# EAGLE design MCB-USI-WM-BN-BM-22-v1.0.0 (EAGLE 7.7.0)

## Sheet 1 of 2
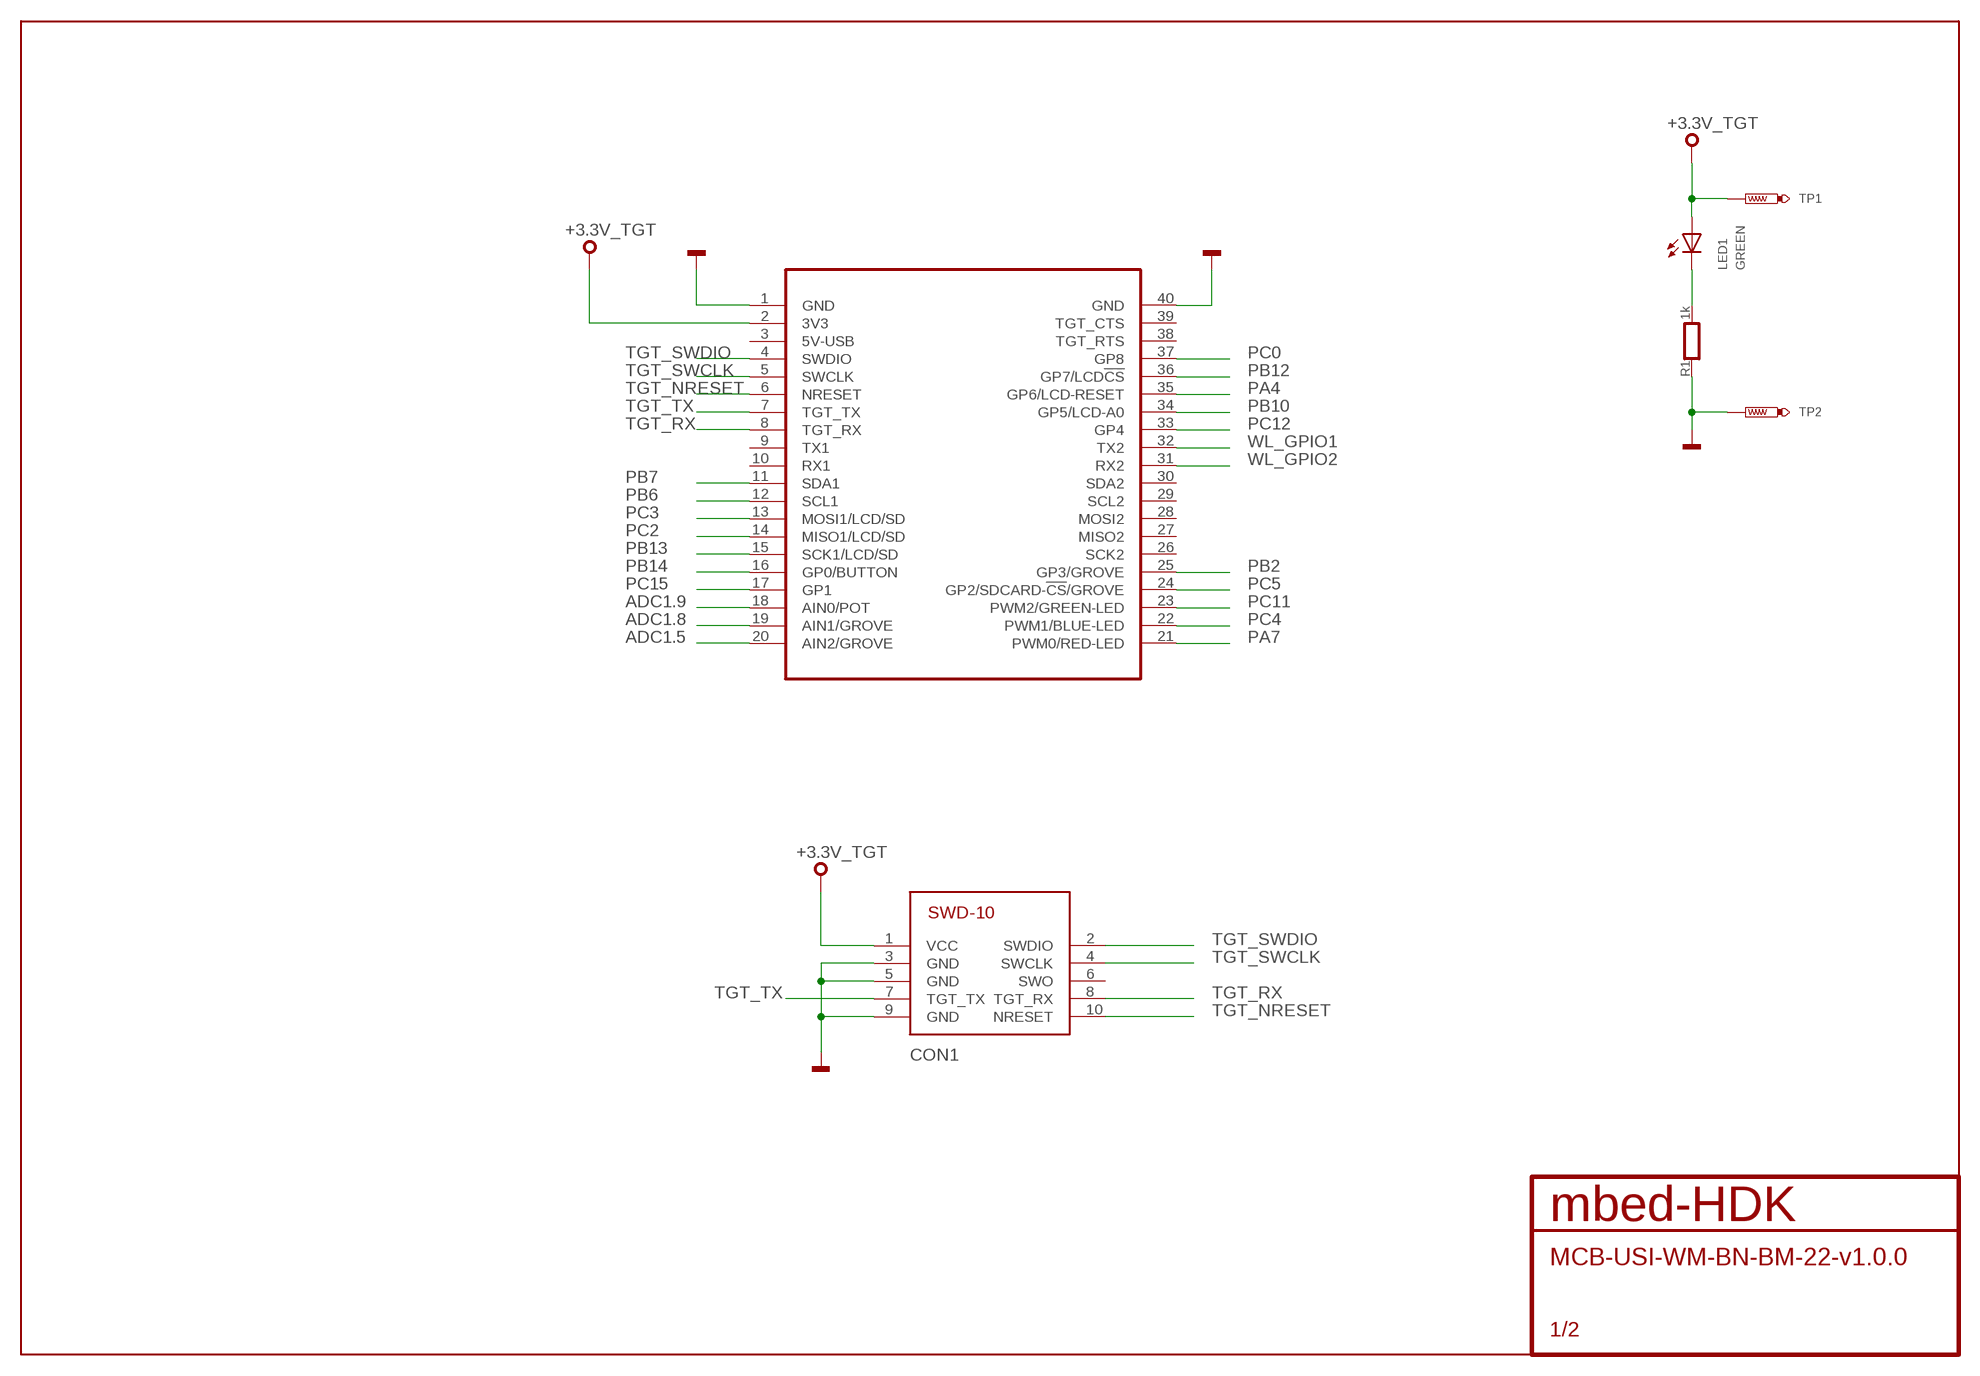
[diagram p0: schematic, sheet 1]

### Parts
CON1  SWD-10/TC2050_SMD  [FTSH-105-02]
LED1  GREEN  SMD_LED0603  [CHIPLED_0603]
MOD1  MODULE_DAUGHTER  [MODULE_DAUGHTER]
R1  1k  R0603  [0603]
TP1  TEST_POINT-50R-PTH  [TP50-PTH]
TP2  TEST_POINT-50R-PTH  [TP50-PTH]

### Nets
+3.3V_TGT: CON1.1(VCC) LED1.A MOD1.2(3V3) TP1.TP ; also sheet 2
ADC1.5: MOD1.20(AIN2/GROVE) ; also sheet 2
ADC1.8: MOD1.19(AIN1/GROVE) ; also sheet 2
ADC1.9: MOD1.18(AIN0/POT) ; also sheet 2
GND: CON1.3(GND) CON1.5(GND) CON1.9(GND) MOD1.1(GND) MOD1.40(GND) R1.1 TP2.TP ; also sheet 2
PA4: MOD1.35(GP6/LCD-RESET) ; also sheet 2
PA7: MOD1.21(PWM0/RED-LED) ; also sheet 2
PA_1: LED1.C R1.2
PB2: MOD1.25(GP3/GROVE) ; also sheet 2
PB6: MOD1.12(SCL1) ; also sheet 2
PB7: MOD1.11(SDA1) ; also sheet 2
PB10: MOD1.34(GP5/LCD-A0) ; also sheet 2
PB12: MOD1.36(GP7/LCD!CS) ; also sheet 2
PB13: MOD1.15(SCK1/LCD/SD) ; also sheet 2
PB14: MOD1.16(GP0/BUTTON) ; also sheet 2
PC0: MOD1.37(GP8) ; also sheet 2
PC2: MOD1.14(MISO1/LCD/SD) ; also sheet 2
PC3: MOD1.13(MOSI1/LCD/SD) ; also sheet 2
PC4: MOD1.22(PWM1/BLUE-LED) ; also sheet 2
PC5: MOD1.24(GP2/SDCARD-!CS!/GROVE) ; also sheet 2
PC11: MOD1.23(PWM2/GREEN-LED) ; also sheet 2
PC12: MOD1.33(GP4) ; also sheet 2
PC15: MOD1.17(GP1) ; also sheet 2
TGT_NRESET: CON1.10(NRESET) MOD1.6(NRESET) ; also sheet 2
TGT_RX: CON1.8(TGT_RX) MOD1.8(TGT_RX) ; also sheet 2
TGT_SWCLK: CON1.4(SWCLK) MOD1.5(SWCLK) ; also sheet 2
TGT_SWDIO: CON1.2(SWDIO) MOD1.4(SWDIO) ; also sheet 2
TGT_TX: CON1.7(TGT_TX) MOD1.7(TGT_TX) ; also sheet 2
WL_GPIO1: MOD1.32(TX2) ; also sheet 2
WL_GPIO2: MOD1.31(RX2) ; also sheet 2
Unconnected: CON1.6(SWO) MOD1.3(5V-USB) MOD1.9(TX1) MOD1.10(RX1) MOD1.26(SCK2) MOD1.27(MISO2) MOD1.28(MOSI2) MOD1.29(SCL2) MOD1.30(SDA2) MOD1.38(TGT_RTS) MOD1.39(TGT_CTS)

## Sheet 2 of 2
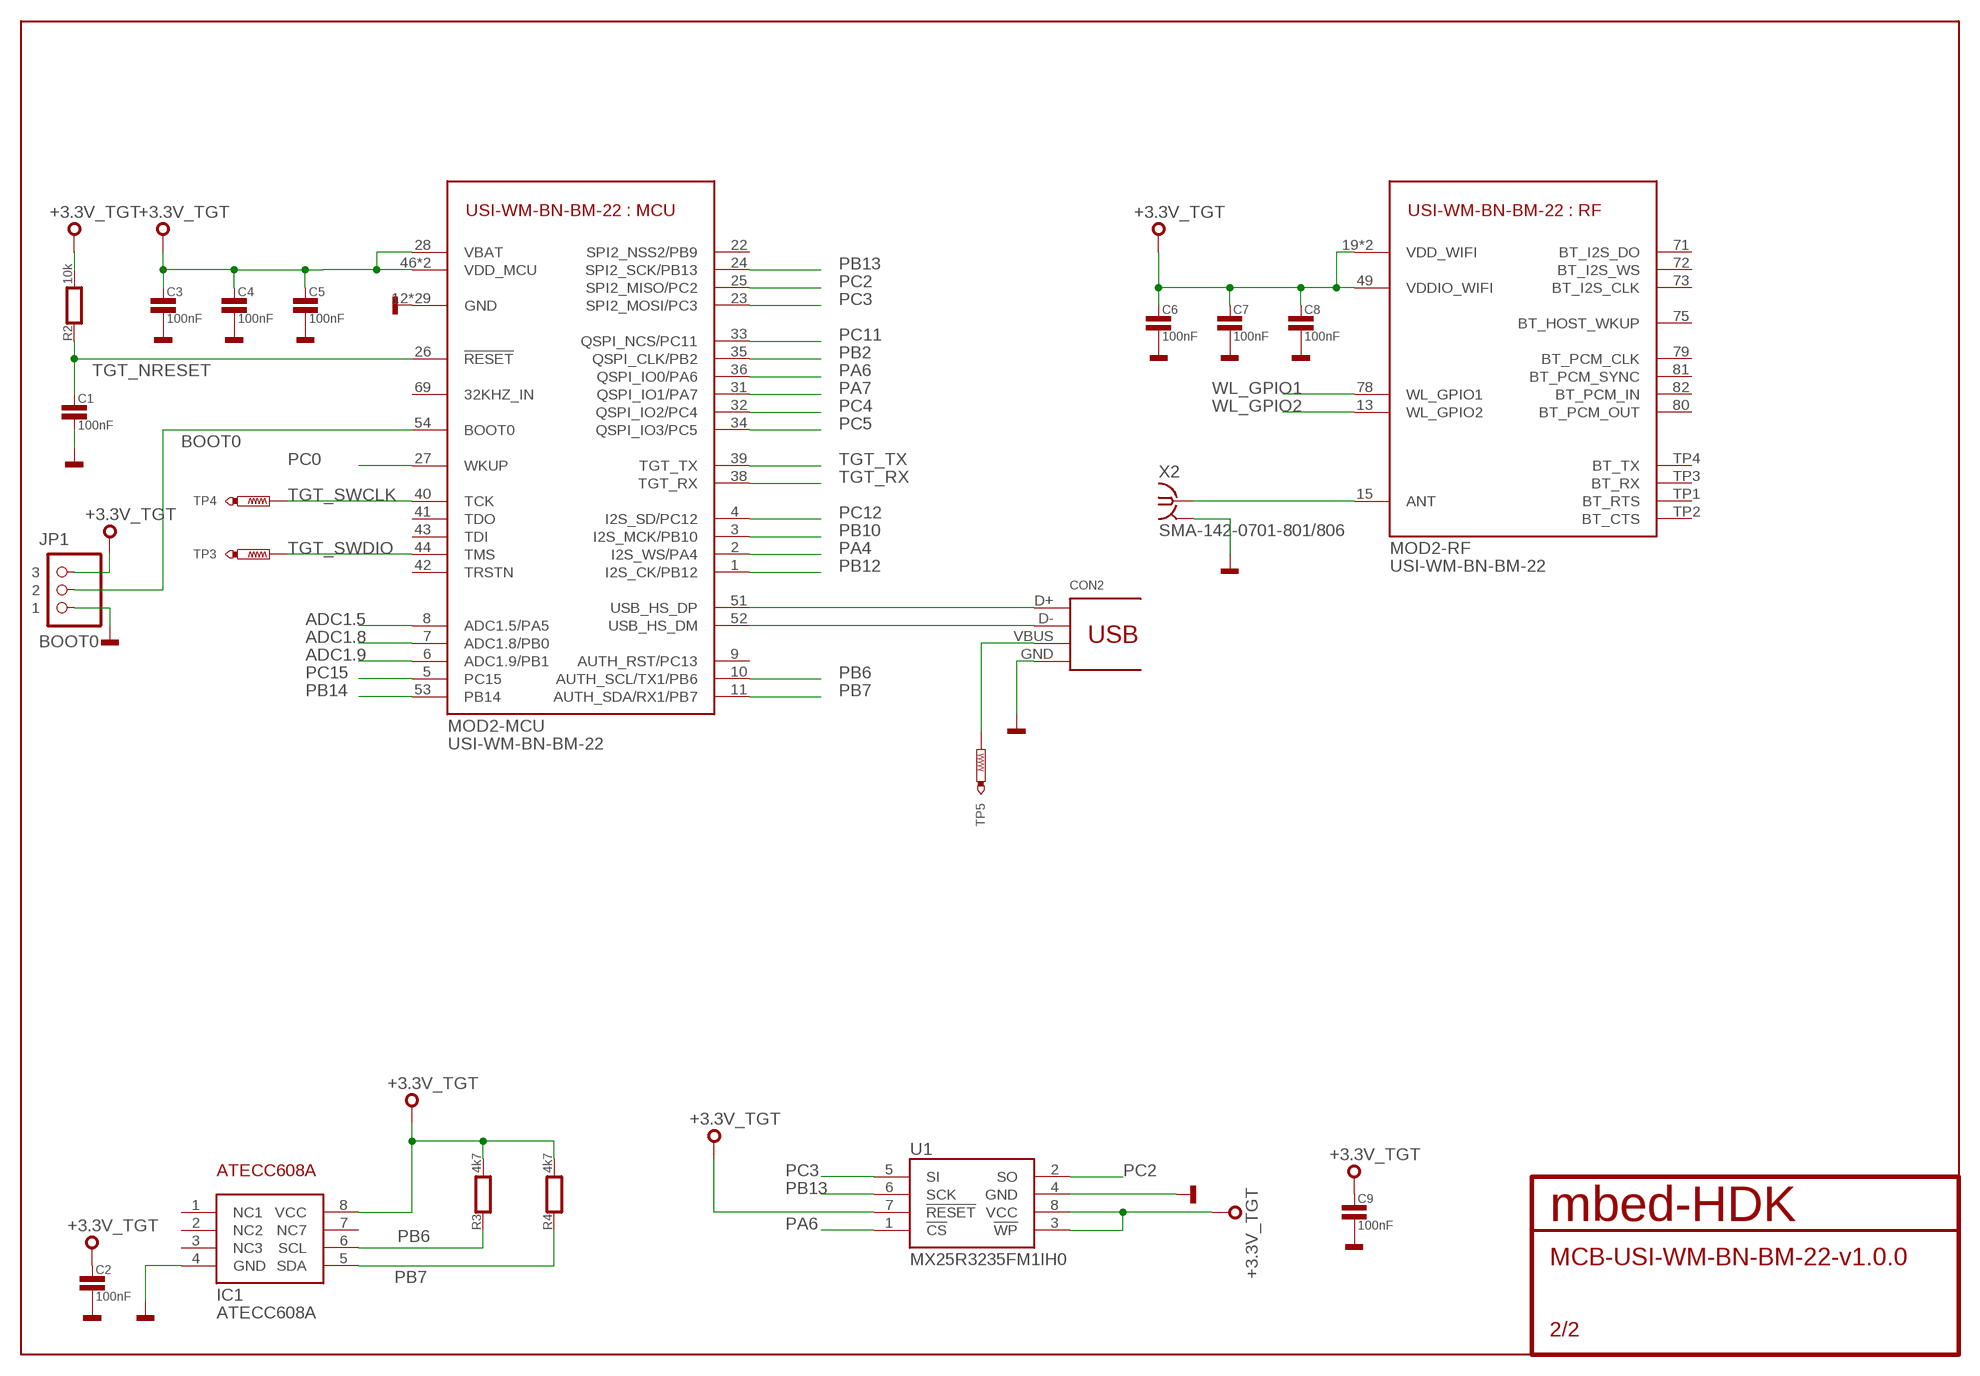
[diagram p1: schematic, sheet 2]

### Parts
C1  100nF  C0603  [0603]
C2  100nF  C0603  [0603]
C3  100nF  C0603  [0603]
C4  100nF  C0603  [0603]
C5  100nF  C0603  [0603]
C6  100nF  C0603  [0603]
C7  100nF  C0603  [0603]
C8  100nF  C0603  [0603]
C9  100nF  C0603  [0603]
CON2  47346-0001  [USB-MICRO-B-H]
IC1  ATECC608A  [SO8]
JP1  BOOT0  PINHD-1X3  [1X03]
MOD2  USI-WM-BN-BM-22  [USI-WM-BN-BM-22]
R2  10k  R0603  [0603]
R3  4k7  R0603  [0603]
R4  4k7  R0603  [0603]
TP3  TEST_POINT-50R-SMD  [TP50-SMD]
TP4  TEST_POINT-50R-SMD  [TP50-SMD]
TP5  TEST_POINT-50R-SMD  [TP50-SMD]
U1  MX25R3235FM1IH0  [SO8]
X2  SMA-142-0701-801/806  [J502-ND-142-0701-801/806]

### Nets
+3.3V_TGT: C2.1 C3.1 C4.1 C5.1 C6.1 C7.1 C8.1 C9.1 IC1.8(VCC) JP1.3 MOD2.19(-RF:VDD_WIFI) MOD2.20(-RF:VDD_WIFI) MOD2.28(-MCU:VBAT) MOD2.46(-MCU:VDD_MCU) MOD2.47(-MCU:VDD_MCU) MOD2.49(-RF:VDDIO_WIFI) R2.2 R3.2 R4.2 U1.3(!WP) U1.7(!RESET) U1.8(VCC) ; also sheet 1
ADC1.5: MOD2.8(-MCU:ADC1.5/PA5) ; also sheet 1
ADC1.8: MOD2.7(-MCU:ADC1.8/PB0) ; also sheet 1
ADC1.9: MOD2.6(-MCU:ADC1.9/PB1) ; also sheet 1
BOOT0: JP1.2 MOD2.54(-MCU:BOOT0)
GND: C1.2 C2.2 C3.2 C4.2 C5.2 C6.2 C7.2 C8.2 C9.2 CON2.GND IC1.4(GND) JP1.1 MOD2.12(-MCU:GND) MOD2.14(-MCU:GND) MOD2.16(-MCU:GND) MOD2.17(-MCU:GND) MOD2.18(-MCU:GND) MOD2.21(-MCU:GND) MOD2.29(-MCU:GND) MOD2.30(-MCU:GND) MOD2.37(-MCU:GND) MOD2.45(-MCU:GND) MOD2.48(-MCU:GND) MOD2.50(-MCU:GND) MOD2.55(-MCU:GND) MOD2.56(-MCU:GND) MOD2.57(-MCU:GND) MOD2.58(-MCU:GND) MOD2.59(-MCU:GND) MOD2.60(-MCU:GND) MOD2.61(-MCU:GND) MOD2.62(-MCU:GND) MOD2.63(-MCU:GND) MOD2.64(-MCU:GND) MOD2.65(-MCU:GND) MOD2.66(-MCU:GND) MOD2.67(-MCU:GND) MOD2.68(-MCU:GND) MOD2.70(-MCU:GND) MOD2.74(-MCU:GND) MOD2.83(-MCU:GND) U1.4(GND) X2.G@1 X2.G@2 X2.G@3 X2.G@4 ; also sheet 1
N$2: CON2.D+ MOD2.51(-MCU:USB_HS_DP)
N$3: CON2.D- MOD2.52(-MCU:USB_HS_DM)
N$5: CON2.VBUS TP5.TP
N$6: MOD2.15(-RF:ANT) X2.1
PA4: MOD2.2(-MCU:I2S_WS/PA4) ; also sheet 1
PA6: MOD2.36(-MCU:QSPI_IO0/PA6) U1.1(!CS)
PA7: MOD2.31(-MCU:QSPI_IO1/PA7) ; also sheet 1
PB2: MOD2.35(-MCU:QSPI_CLK/PB2) ; also sheet 1
PB6: IC1.6(SCL) MOD2.10(-MCU:AUTH_SCL/TX1/PB6) R3.1 ; also sheet 1
PB7: IC1.5(SDA) MOD2.11(-MCU:AUTH_SDA/RX1/PB7) R4.1 ; also sheet 1
PB10: MOD2.3(-MCU:I2S_MCK/PB10) ; also sheet 1
PB12: MOD2.1(-MCU:I2S_CK/PB12) ; also sheet 1
PB13: MOD2.24(-MCU:SPI2_SCK/PB13) U1.6(SCK) ; also sheet 1
PB14: MOD2.53(-MCU:PB14) ; also sheet 1
PC0: MOD2.27(-MCU:WKUP) ; also sheet 1
PC2: MOD2.25(-MCU:SPI2_MISO/PC2) U1.2(SO) ; also sheet 1
PC3: MOD2.23(-MCU:SPI2_MOSI/PC3) U1.5(SI) ; also sheet 1
PC4: MOD2.32(-MCU:QSPI_IO2/PC4) ; also sheet 1
PC5: MOD2.34(-MCU:QSPI_IO3/PC5) ; also sheet 1
PC11: MOD2.33(-MCU:QSPI_NCS/PC11) ; also sheet 1
PC12: MOD2.4(-MCU:I2S_SD/PC12) ; also sheet 1
PC15: MOD2.5(-MCU:PC15) ; also sheet 1
TGT_NRESET: C1.1 MOD2.26(-MCU:!RESET) R2.1 ; also sheet 1
TGT_RX: MOD2.38(-MCU:TGT_RX) ; also sheet 1
TGT_SWCLK: MOD2.40(-MCU:TCK) TP4.TP ; also sheet 1
TGT_SWDIO: MOD2.44(-MCU:TMS) TP3.TP ; also sheet 1
TGT_TX: MOD2.39(-MCU:TGT_TX) ; also sheet 1
WL_GPIO1: MOD2.78(-RF:WL_GPIO1) ; also sheet 1
WL_GPIO2: MOD2.13(-RF:WL_GPIO2) ; also sheet 1
Unconnected: IC1.1(NC1) IC1.2(NC2) IC1.3(NC3) IC1.7(NC7) MOD2.9(-MCU:AUTH_RST/PC13) MOD2.22(-MCU:SPI2_NSS2/PB9) MOD2.41(-MCU:TDO) MOD2.42(-MCU:TRSTN) MOD2.43(-MCU:TDI) MOD2.69(-MCU:32KHZ_IN) MOD2.71(-RF:BT_I2S_DO) MOD2.72(-RF:BT_I2S_WS) MOD2.73(-RF:BT_I2S_CLK) MOD2.75(-RF:BT_HOST_WKUP) MOD2.79(-RF:BT_PCM_CLK) MOD2.80(-RF:BT_PCM_OUT) MOD2.81(-RF:BT_PCM_SYNC) MOD2.82(-RF:BT_PCM_IN) MOD2.TP1(-RF:BT_RTS) MOD2.TP2(-RF:BT_CTS) MOD2.TP3(-RF:BT_RX) MOD2.TP4(-RF:BT_TX)

## Library data of the parts
C1-C9 = mbed-HDK-RLC:C: Capacitor
CON1 = mbed-HDK-Connector:SWD-10/TC2050: 1mm pitch 10-Pin Cortex Programming Header with optional TC2050 footprint solderless interchangeable
CON2 = mbed-HDK-Connector:47346-0001: USB Receptacle Horizontal Micro Type B; MF: MOLEX; MFN: 47346-0001; OC-MOUSER: 538-47346-0001; OC-NEWARK: 1568026
IC1 = mbed-HDK-MF-ATMEL:ATECC608A: I2C Secure element and crytpo accelerator; MF: Atmel; MFN: ATECC608A; OC-DIGIKEY: ATECC608A-SSHDA-TCT-ND; OC-MOUSER: 556-ATECC608ASSHDAB
JP1 = mbed-HDK-Connector:PINHD-1X3: PIN HEADER
LED1 = mbed-HDK-Optical:SMD_LED: LED SMD, Colour Red; MF: Wurth Electronics Inc; MFN: 150060RS75000; OC-DIGIKEY: 732-4978-1-ND; OC-MOUSER: 710-150060RS75000; OC-NEWARK: 2322071
MOD1 = mbed-HDK-misc-Board:MODULE_DAUGHTER
MOD2 = mbed-HDK-Modules:USI-WM-BN-BM-22
R1-R4 = mbed-HDK-RLC:R: Resistor
TP1-TP5 = mbed-HDK-Connector:TEST_POINT
U1 = mbed-HDK-IC:MX25R3235FM1IH0: Serial Flash 32 Mb 80 Mhz; MF: Macronix; MFN: MX25R3235FM1IH0; OC-DIGIKEY: 1092-1175-ND
X2 = mbed-HDK-Connector:SMA-: SMA 50 Ohm End Launch Jack Receptacle - Round Contact Johnson Components Source: www.johnsoncomponents.com .. J502-ND.pdf; MF: JOHNSON COMPONENTS; MPN: 142-0701-801; OC_FARNELL: 1608592; OC_NEWARK: 90F2624

## Board
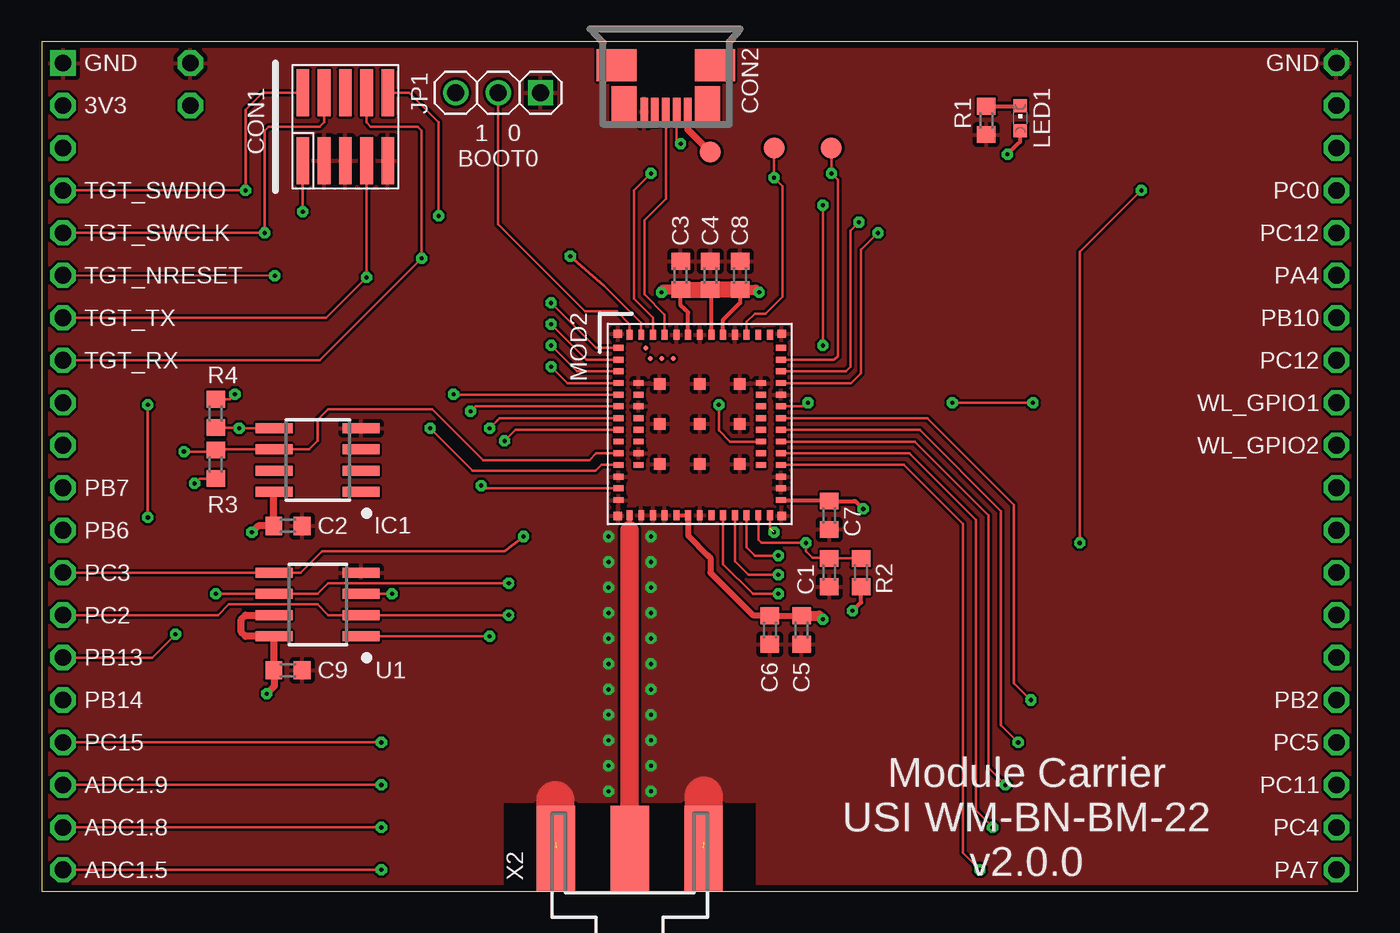
[diagram p2: board, top side]
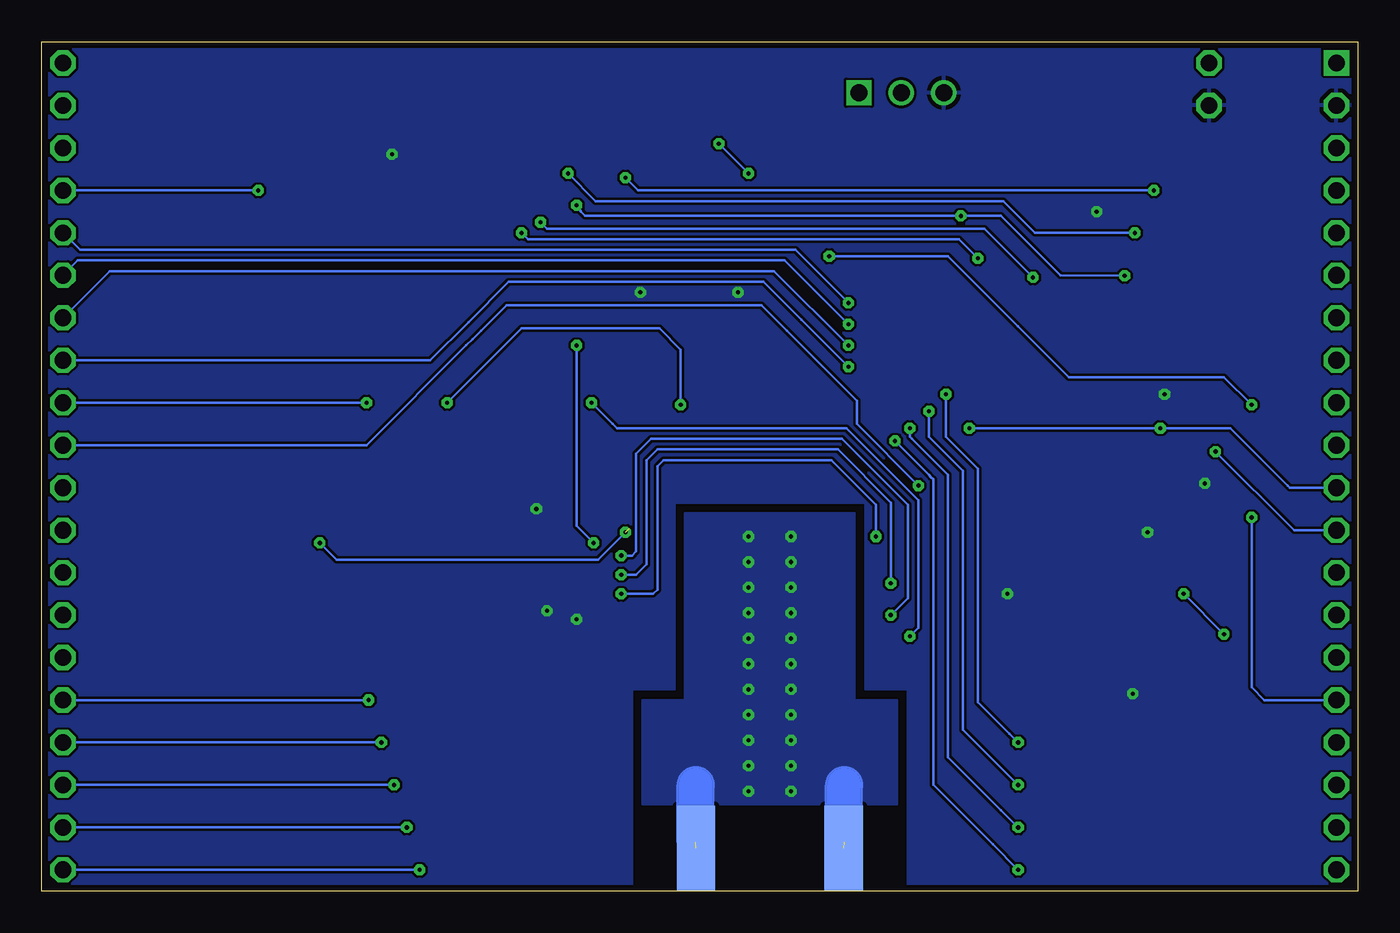
[diagram p3: board, bottom side, seen from below]

Size 78.74 x 50.8 mm. Coordinates in mm from the lower left corner, seen from the top.
Copper layers ((1*16)): Top 0.035mm / dielectric 0.8mm / Bottom 0.035mm
Design rules "mbed-HDK-6-6-2-layer": minimum track width 6mil, minimum drill 9mil, track to track 6mil, track to pad 6mil, pad to pad 6mil, via to via 6mil, smd to smd 6mil, copper to edge 15mil, drill to drill 8mil, minimum pad ring 10mil, minimum via ring 8mil, stop-mask expansion 4mil, vias tented up to drill 0mil, thermal gap 10mil

### Footprints (pad centres in the part's own frame; a part is rotated, then mirrored left to right if it is on the bottom)
0603 = smd 1 x 1.1: 1 -0.85,0; 2 0.85,0
FTSH-105-02 = smd 0.762 x 2.794: 1 0.381,-2.032; 2 0.381,2.032; 3 1.651,-2.032; 4 1.651,2.032; 5 2.921,-2.032; 6 2.921,2.032; 7 4.191,-2.032; 8 4.191,2.032; 9 5.461,-2.032; 10 5.461,2.032
USB-MICRO-B-H = smd 1.7 x 0.45: 4 2.8,-0.65; D+ 2.8,0; D- 2.8,0.65; GND 2.8,-1.3; VBUS 2.8,1.3 | smd 1.9 x 2.375: GND1 0,2.95; GND4 0,-2.95 | smd 2.1 x 1.475: GND2 2.3,2.5; GND3 2.3,-2.5
SO8 = smd 0.6 x 2.2: 1 -1.905,-2.6; 2 -0.635,-2.6; 3 0.635,-2.6; 4 1.905,-2.6; 5 1.905,2.6; 6 0.635,2.6; 7 -0.635,2.6; 8 -1.905,2.6
1X03 = drill 1.016 square: 1 -2.54,0 | drill 1.016: 2 0,0; 3 2.54,0
CHIPLED_0603 = smd 0.8 x 0.8: A 0,-0.75; C 0,0.75
MODULE_DAUGHTER = drill 1 square: 1 0,0 | drill 1 octagon: 2 0,-2.54; 3 0,-5.08; 4 0,-7.62; 5 0,-10.16; 6 0,-12.7; 7 0,-15.24; 8 0,-17.78; 9 0,-20.32; 10 0,-22.86; 11 0,-25.4; 12 0,-27.94; 13 0,-30.48; 14 0,-33.02; 15 0,-35.56; 16 0,-38.1; 17 0,-40.64; 18 0,-43.18; 19 0,-45.72; 20 0,-48.26; 21 76.2,-48.26; 22 76.2,-45.72; 23 76.2,-43.18; 24 76.2,-40.64; 25 76.2,-38.1; 26 76.2,-35.56; 27 76.2,-33.02; 28 76.2,-30.48; 29 76.2,-27.94; 30 76.2,-25.4; 31 76.2,-22.86; 32 76.2,-20.32; 33 76.2,-17.78; 34 76.2,-15.24; 35 76.2,-12.7; 36 76.2,-10.16; 37 76.2,-7.62; 38 76.2,-5.08; 39 76.2,-2.54; 40 76.2,0
USI-WM-BN-BM-22 = smd 0.35 x 0.6: 1 4.55,4.85; 2 3.85,4.85; 3 3.15,4.85; 4 2.45,4.85; 5 1.75,4.85; 6 1.05,4.85; 7 0.35,4.85; 8 -0.35,4.85; 9 -1.05,4.85; 10 -1.75,4.85; 11 -2.45,4.85; 12 -3.15,4.85; 13 -3.85,4.85; 14 -4.55,4.85; 28 -4.55,-4.85; 29 -3.85,-4.85; 30 -3.15,-4.85; 31 -2.45,-4.85; 32 -1.75,-4.85; 33 -1.05,-4.85; 34 -0.35,-4.85; 35 0.35,-4.85; 36 1.05,-4.85; 37 1.75,-4.85; 38 2.45,-4.85; 39 3.15,-4.85; 40 3.85,-4.85; 41 4.55,-4.85; 68 2.45,3.65; 69 1.75,3.65; 70 1.05,3.65; 71 0.35,3.65; 72 -0.35,3.65; 73 -1.05,3.65; 74 -1.75,3.65; 75 -2.45,3.65; 76 -2.45,-3.65; 77 -1.75,-3.65; 78 -1.05,-3.65; 79 -0.35,-3.65; 80 0.35,-3.65; 81 1.05,-3.65; 82 1.75,-3.65; 83 2.45,-3.65 | smd 0.6 x 0.35: 15 -5.45,4.2; 16 -5.45,3.5; 17 -5.45,2.8; 18 -5.45,2.1; 19 -5.45,1.4; 20 -5.45,0.7; 21 -5.45,0; 22 -5.45,-0.7; 23 -5.45,-1.4; 24 -5.45,-2.1; 25 -5.45,-2.8; 26 -5.45,-3.5; 27 -5.45,-4.2; 42 5.35,-4.2; 43 5.35,-3.5; 44 5.35,-2.8; 45 5.35,-2.1; 46 5.35,-1.4; 47 5.35,-0.7; 48 5.35,0; 49 5.35,0.7; 50 5.35,1.4; 51 5.35,2.1; 52 5.35,2.8; 53 5.35,3.5; 54 5.35,4.2 | smd 0.5 x 0.5: 55 5.4,4.9; 56 -5.5,4.9; 57 -5.5,-4.9; 58 5.4,-4.9 | smd 0.7 x 0.7: 59 2.4,2.4; 60 0,2.4; 61 -2.4,2.4; 62 2.4,0; 63 0,0; 64 -2.4,0; 65 2.4,-2.4; 66 0,-2.4; 67 -2.4,-2.4 | smd 0.3 x 0.3: TP1 3.91,1.58; TP2 3.91,2.96; TP3 4.53,3.24; TP4 3.91,2.27
TP50-PTH = drill 1 octagon: TP 0,0
TP50-SMD = smd 1.27 x 1.27: TP 0,0
J502-ND-142-0701-801/806 = smd 5.08 x 2.286: 1 2.565,0; G@1 2.565,4.42; G@2 2.565,-4.42 | smd 5.08 x 2.286 bottom: G@3 2.565,4.42; G@4 2.565,-4.42

### Placement (x,y rotation side)
C1  47.12,19.05 270 top
C2  14.73,21.84 0 top
C3  38.23,36.83 90 top
C4  40.01,36.83 90 top
C5  45.47,15.62 270 top
C6  43.56,15.62 270 top
C7  47.12,22.48 270 top
C8  41.78,36.83 90 top
C9  14.73,13.21 0 top
CON1  15.24,45.72 0 top
CON2  37.34,49.4 270 top
IC1  16.51,25.78 90 top
JP1  27.3,47.75 180 top
LED1  58.55,46.23 0 top
MOD1  1.27,49.53 0 top
MOD2  39.37,27.94 90 top
R1  56.52,46.1 90 top
R2  49.02,19.05 270 top
R3  10.41,25.53 270 top
R4  10.41,28.58 90 top
TP1  8.89,46.99 0 top
TP2  8.89,49.53 0 top
TP3  43.82,44.45 0 top
TP4  47.24,44.45 0 top
TP5  40.01,44.2 0 top
U1  16.51,17.15 90 top
X2  35.18,0 90 top

### Tracks (layer width: path | path; a pad name or v marks a point on that pad's centre or on a via)
+3.3V_TGT  (via drill 0.25)
  Top 0.152: CON1.1 v15.62,40.64 | R3.2 9.44,24.68 v9.14,24.38 | R4.2 11.26,29.43 v11.56,29.72 | U1.3 v20.95,17.78
  Top 0.254: MOD2.28 47.12,23.39 C7.1 48.6,23.33 48.68,23.33 v49.15,22.86 | MOD2.49 38.67,34.61 38.48,34.8 | 38.48,34.8 38.23,35.05 | 40.07,35.91 C4.1 40.07,35.91 | MOD2.46 40.77,34.17 41.78,35.18 C8.1 | MOD2.47 40.07,35.91 | 38.23,35.05 38.48,34.8 | 38.23,35.05 C3.1 | MOD2.19 MOD2.20 | v57.79,44.07 58.42,44.7 58.55,44.83 LED1.A | v48.51,16.76 49.02,17.27 R2.2
  Top 0.356: MOD2.20 38.67,21.27 39.88,20.07 40.01,19.94 40.01,19.05 41.53,17.53 42.55,16.51 43.52,16.51 C6.1 C5.1
  Top 0.406: 13.91,13.24 C9.1 | 13.91,13.24 13.91,12.26 v13.46,11.81 | 13.91,13.24 U1.8 12.19,15.24 11.94,15.49 11.94,16.26 12.19,16.51 U1.7 | v12.57,21.46 12.95,21.84 C2.1 13.88,23.85 IC1.8
  Top 0.61: C8.1 42.71,35.98 v42.93,35.81 | C3.1 37.17,35.98 v37.08,35.81 | C5.1 46.52,16.47 v46.74,16.26
  Top 0.965: C3.1 C4.1 C8.1
  pour Bottom: 0,0 26.92,0 26.92,12.06 29.46,12.06 29.46,23.24 40.89,23.24 40.89,12.06 43.43,12.06 43.43,0 78.74,0 78.74,50.8 0,50.8
ADC1.5  (via drill 0.25)
  Top 0.152: MOD2.8 28.35,27.59 v27.69,26.92 | v20.32,1.27 MOD1.20
  Bottom 0.152: v27.69,26.92 25.65,24.89 25.53,24.77 25.4,24.64 25.4,21.08 25.4,7.24 25.4,6.35 21.84,2.79 v20.32,1.27
ADC1.8  (via drill 0.25)
  Top 0.152: v20.32,3.81 MOD1.19 | MOD2.7 27.4,28.29 27.27,28.16 v26.8,27.69
  Bottom 0.152: v20.32,3.81 21.34,4.83 24.51,8 24.51,21.46 24.51,22.99 24.51,24.89 26.67,27.05 26.8,27.18 v26.8,27.69
ADC1.9  (via drill 0.25)
  Top 0.152: MOD2.6 25.94,28.99 v25.65,28.7 | v20.32,6.35 MOD1.18
  Bottom 0.152: v20.32,6.35 23.62,9.65 23.62,25.15 25.65,27.18 25.65,27.81 v25.65,28.7
BOOT0
  Top 0.152: MOD2.54 35.17,33.92 34.42,34.67 32.51,34.67 27.3,39.88 JP1.2
GND  (via drill 0.25)  (4 unrouted)
  Top 2.286: 30.73,3.81 30.73,5.33 30.73,5.46 | 39.62,4.19 39.62,5.72
  Bottom 2.286: 30.73,2.92 30.73,6.35 | 39.62,2.92 39.62,6.35
  other vias: 33.91,21.21 33.91,19.69 33.91,18.16 33.91,16.64 33.91,15.11 33.91,13.59 33.91,12.06 33.91,10.54 33.91,9.02 33.91,7.49 33.91,5.97 36.45,5.97 36.45,7.49 36.45,9.02 36.45,10.54 36.45,12.06 36.45,13.59 36.45,15.11 36.45,16.64 36.45,18.16 36.45,19.69 36.45,21.21
  pour Top: 0,0 27.56,0 27.56,5.33 42.8,5.33 42.8,0 78.74,0 78.74,50.8 0,50.8
  pour Bottom: 27.56,5.21 42.8,5.21 42.8,11.43 40.26,11.43 40.26,22.61 30.1,22.61 30.1,11.43 27.56,11.43
N$2
  Top 0.152: MOD2.51 37.27,34.48 36.07,35.69 36.07,40.13 37.34,41.4 CON2.D+
N$3  (via drill 0.25)
  Top 0.152: MOD2.52 36.57,34.3 35.43,35.43 35.43,41.91 v36.45,42.93 | v38.23,44.7 37.97,44.96 37.97,46.59 CON2.D-
  Bottom 0.152: v36.45,42.93 v38.23,44.7
N$5
  Top 0.406: CON2.VBUS 38.64,45.56 39.24,44.96 TP5.TP
N$6
  Top 0.254: MOD2.15 35.18,22.35 35.18,21.59
  Top 1.092: 35.18,21.59 X2.1
PA4  (via drill 0.25)
  Top 0.152: MOD2.2 32.6,31.79 v30.48,33.91
  Bottom 0.152: MOD1.35 76.58,37.72 34.42,37.72 34.29,37.72 v30.48,33.91
PA6  (via drill 0.25)
  Top 0.152: MOD2.36 45.63,28.99 v45.85,29.21 | U1.1 v26.8,15.24
  Bottom 0.152: v45.85,29.21 44.58,27.94 44.32,27.69 40.39,27.69 32.89,27.69 30.86,27.69 30.61,27.69 26.29,23.37 26.29,15.75 v26.8,15.24
PA7  (via drill 0.25)
  Top 0.152: MOD2.31 51.6,25.49 55.12,21.97 55.12,2.29 v56.13,1.27
  Bottom 0.152: v56.13,1.27 MOD1.21
PA_1
  Top 0.254: R1.2 58.52,46.95 LED1.C
PB2  (via drill 0.25)
  Top 0.152: MOD2.35 52.99,28.29 58.17,23.11 58.17,12.45 v59.18,11.43
  Bottom 0.152: v59.18,11.43 MOD1.25
PB6  (via drill 0.25)
  Top 0.152: MOD2.10 33.18,26.19 32.77,25.78 26.42,25.78 23.37,28.83 17.14,28.83 16.51,28.19 16.51,26.92 16,26.42 IC1.6 10.45,26.42 R3.1 10.33,26.29 v8.51,26.29
  Bottom 0.152: v8.51,26.29 3.81,21.59 MOD1.12
PB7  (via drill 0.25)
  Top 0.152: MOD2.11 33.49,25.49 33.15,25.15 25.78,25.15 v23.24,27.69 | R4.1 11.77,27.73 v11.81,27.69 IC1.5
  Bottom 0.152: v23.24,27.69 v11.81,27.69 7.62,27.69 4.19,24.26 4.06,24.13 MOD1.11
PB10  (via drill 0.25)
  Top 0.152: MOD2.3 32.03,31.09 v30.48,32.64
  Bottom 0.152: v30.48,32.64 34.93,37.08 70.74,37.08 74.68,37.08 MOD1.34
PB12  (via drill 0.25)
  Top 0.152: MOD2.1 33.17,32.49 v30.48,35.18
  Bottom 0.152: MOD1.36 76.45,38.35 34.93,38.35 33.66,38.35 v30.48,35.18
PB13  (via drill 0.25)
  Top 0.152: MOD1.15 6.6,13.97 v8,15.37 | v10.41,17.78 U1.6 16.51,17.78 17.14,18.42 v27.94,18.42 | v44.07,18.92 42.29,18.92 41.47,19.74 MOD2.24
  Bottom 0.152: v8,15.37 v10.41,17.78 | v27.94,18.42 27.94,21.08 27.94,23.24 31.11,26.42 40.51,26.42 41.91,26.42 42.55,25.78 42.55,19.56 43.18,18.92 v44.07,18.92
PB14  (via drill 0.25)
  Top 0.152: MOD2.53 35.87,33.98 33.66,36.2 v31.62,37.97 | v6.35,29.08 v6.35,22.35
  Bottom 0.152: v31.62,37.97 24.51,37.97 20.32,33.78 17.27,30.73 8,30.73 v6.35,29.08 | v6.35,22.35 6.35,12.19 5.59,11.43 MOD1.16
PC0  (via drill 0.25)  (1 unrouted)
  Top 0.152: MOD2.27 43.57,21.71 | v62.1,20.83 62.1,38.23 v65.79,41.91
  Bottom 0.152: v43.82,21.46 45.47,19.81 61.09,19.81 v62.1,20.83 | v65.79,41.91 MOD1.37
PC2  (via drill 0.25)
  Top 0.152: MOD1.14 10.54,16.51 11.18,17.15 16.51,17.15 17.14,16.51 U1.2 v27.94,16.51 | v44.07,20.07 42.67,20.07 42.16,20.57 MOD2.25
  Bottom 0.152: v27.94,16.51 26.92,17.53 26.92,23.11 30.86,27.05 40.89,27.05 42.29,27.05 43.18,26.16 43.18,20.32 43.43,20.07 v44.07,20.07
PC3  (via drill 0.25)
  Top 0.152: MOD1.13 U1.5 15.49,19.05 16.76,20.32 27.69,20.32 v28.83,21.21 | v44.07,17.78 42.55,17.78 40.77,19.56 MOD2.23
  Bottom 0.152: v28.83,21.21 28.83,23.11 31.5,25.78 39.5,25.78 41.53,25.78 41.91,25.4 41.91,18.03 42.16,17.78 v44.07,17.78
PC4  (via drill 0.25)
  Top 0.152: MOD2.32 51.92,26.19 55.88,22.23 55.88,4.83 v56.9,3.81
  Bottom 0.152: v56.9,3.81 MOD1.22
PC5  (via drill 0.25)
  Top 0.152: MOD2.34 52.55,27.59 57.4,22.73 57.4,9.91 v58.42,8.89
  Bottom 0.152: v58.42,8.89 MOD1.24
PC11  (via drill 0.25)
  Top 0.152: MOD2.33 52.23,26.89 56.64,22.48 56.64,7.37 v57.66,6.35
  Bottom 0.152: v57.66,6.35 MOD1.23
PC12  (via drill 0.25)
  Top 0.152: MOD2.4 31.46,30.39 v30.48,31.37
  Bottom 0.152: MOD1.33 55.5,31.75 53.21,34.04 50.8,36.45 40.64,36.45 36.2,36.45 35.56,36.45 33.27,34.16 v30.48,31.37
PC15  (via drill 0.25)
  Top 0.152: v20.32,8.89 MOD1.17 | MOD2.5 24.67,29.69 v24.64,29.72
  Bottom 0.152: v20.32,8.89 20.83,9.4 22.73,11.3 22.73,25.27 24.64,27.18 v24.64,29.72
TGT_NRESET  (via drill 0.25)
  Top 0.152: MOD1.6 v13.95,36.8 | CON1.10 21.97,47.75 23.75,45.97 v23.75,40.39 | R2.1 C1.1 47.08,19.94 46.1,19.94 45.72,20.32 v45.72,20.83 43.05,20.83 42.87,21.01 MOD2.26 | v46.74,32.64 46.74,33.66 v46.74,41.02
  Bottom 0.152: v13.95,36.8 17.78,36.83 21.34,40.39 v23.75,40.39 27.81,40.39 27.94,40.39 46.23,40.39 46.48,40.64 v46.74,41.02 | v46.74,32.64 46.74,21.84 v45.72,20.83
TGT_RX  (via drill 0.25)
  Top 0.152: MOD1.8 16.64,31.75 v22.73,37.85 22.73,45.47 22.48,45.72 19.68,45.72 19.43,45.97 19.43,46.23 CON1.8 | MOD2.38 48.42,30.39 49.02,30.99 49.02,38.35 v50.04,39.37
  Bottom 0.152: v22.73,37.85 23.88,38.99 28.07,38.99 49.66,38.99 v50.04,39.37
TGT_SWCLK  (via drill 0.25)
  Top 0.152: MOD1.5 v13.33,39.37 13.33,45.47 13.59,45.72 16.64,45.72 16.89,45.97 CON1.4 | MOD2.40 47.41,31.79 47.62,32 47.62,42.55 v47.24,42.93 TP4.TP
  Bottom 0.152: v13.33,39.37 19.3,39.37 21.21,41.27 24.38,41.27 27.94,41.27 45.59,41.27 v47.24,42.93
TGT_SWDIO  (via drill 0.25)
  Top 0.152: MOD1.4 v12.19,41.91 12.19,46.74 13.21,47.75 CON1.2 | MOD2.44 42.17,34.04 42.67,34.54 43.31,34.54 44.32,35.56 44.32,42.16 v43.82,42.67 TP3.TP
  Bottom 0.152: v12.19,41.91 24.38,41.91 27.94,41.91 34.67,41.91 43.05,41.91 v43.82,42.67
TGT_TX  (via drill 0.25)
  Top 0.152: MOD1.7 17.02,34.29 v19.43,36.7 CON1.7 | MOD2.39 48.11,31.09 48.39,31.37 48.39,39.5 v48.9,40.01
  Bottom 0.152: v19.43,36.7 22.35,39.62 24.77,39.62 28.07,39.62 48.51,39.62 v48.9,40.01
WL_GPIO1  (via drill 0.25)
  Top 0.152: MOD2.78 41.18,26.89 40.51,27.56 v40.51,29.08 | v54.48,29.21 v59.31,29.21
  Bottom 0.152: v40.51,29.08 40.51,32.39 41.78,33.66 50.04,33.66 v54.48,29.21 | v59.31,29.21 MOD1.32
WL_GPIO2  (via drill 0.25)
  Top 0.152: MOD2.13 26.58,24.09 v26.29,24.26
  Bottom 0.152: MOD1.31 59.31,26.67 53.34,32.64 52.96,33.02 52.45,33.53 50.93,35.05 37.34,35.05 35.69,35.05 34.16,33.53 29.97,29.34 29.97,27.94 v26.29,24.26

### Text on the board
tPlace: GND / 3V3 / / TGT_SWDIO / TGT_SWCLK / TGT_NRESET / TGT_TX / TGT_RX / / / PB7 / PB6 / PC3 / PC2 / PB13 / PB14 / PC15 / ADC1.9 / ADC1.8 / ADC1.5 | GND / / / PC0 / PC12 / PA4 / PB10 / PC12 / WL_GPIO1 / WL_GPIO2 / / / / / / PB2 / PC5 / PC11 / PC4 / PA7 | 1 0 / BOOT0 | Module Carrier / USI WM-BN-BM-22 / v2.0.0